# EAGLE design main (EAGLE 5.11)

## Sheet 1 of 2
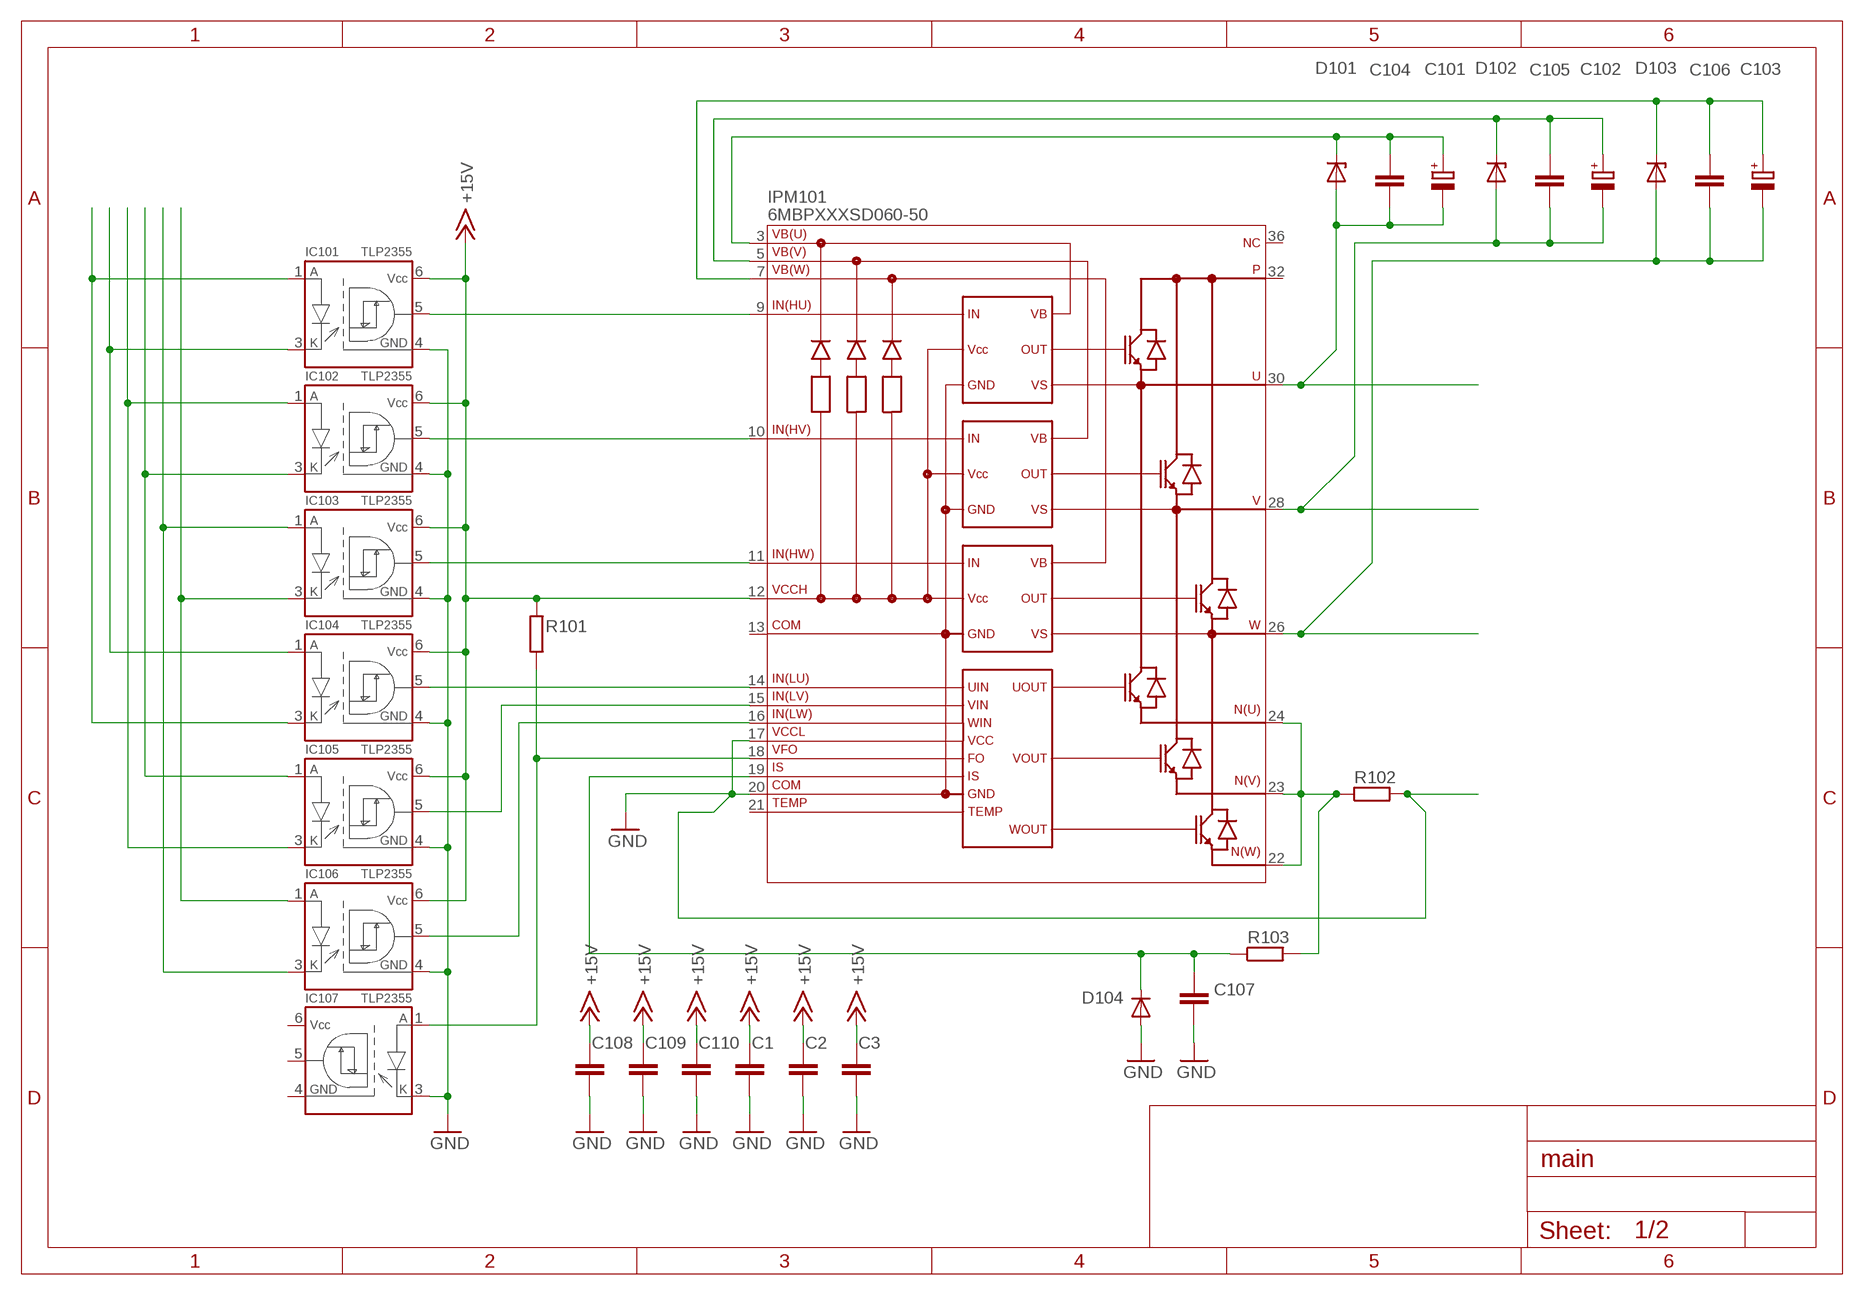
[diagram p0: schematic, sheet 1]

### Parts
C1  C-EUC0805  [C0805]
C2  C-EUC0805  [C0805]
C3  C-EUC0805  [C0805]
C101  CPOL-EU153CLV-0405  [153CLV-0405]
C102  CPOL-EU153CLV-0405  [153CLV-0405]
C103  CPOL-EU153CLV-0405  [153CLV-0405]
C104  C-EUC0805  [C0805]
C105  C-EUC0805  [C0805]
C106  C-EUC0805  [C0805]
C107  C-EUC0805  [C0805]
C108  C-EUC0805  [C0805]
C109  C-EUC0805  [C0805]
C110  C-EUC0805  [C0805]
D101  ZENER-DIODESOD80C  [SOD80C]
D102  ZENER-DIODESOD80C  [SOD80C]
D103  ZENER-DIODESOD80C  [SOD80C]
D104  DIODE-SOD123  [SOD123]
IC101  TLP2355  [11-4L1S]
IC102  TLP2355  [11-4L1S]
IC103  TLP2355  [11-4L1S]
IC104  TLP2355  [11-4L1S]
IC105  TLP2355  [11-4L1S]
IC106  TLP2355  [11-4L1S]
IC107  TLP2355  [11-4L1S]
IPM101  6MBPXXXSD060-50  6MBP  [6MBPXXXSD060-50]
R101  R-EU_R0805  [R0805]
R102  R-EU_R6332W  [R6332W]
R103  R-EU_R0805  [R0805]

### Nets
+15V: C1.1 C2.1 C3.1 C108.1 C109.1 C110.1 IC101.6(VCC) IC102.6(VCC) IC103.6(VCC) IC104.6(VCC) IC105.6(VCC) IC106.6(VCC) IPM101.12 R101.2
GND: C1.2 C2.2 C3.2 C107.2 C108.2 C109.2 C110.2 D104.A IC101.4(GND) IC102.4(GND) IC103.4(GND) IC104.4(GND) IC105.4(GND) IC106.4(GND) IC107.3(K) IPM101.17 IPM101.20 R102.2
N$1: IC107.1(A) IPM101.18 R101.1
N$2: C103.+ C106.2 D103.C IPM101.7
N$3: C102.+ C105.2 D102.C IPM101.5
N$4: C101.+ C104.2 D101.C IPM101.3
N$5: C103.- C106.1 D103.A IPM101.26
N$6: C102.- C105.1 D102.A IPM101.28
N$7: C101.- C104.1 D101.A IPM101.30
N$8: C107.1 D104.C IPM101.19 R103.1
N$9: IPM101.22 IPM101.23 IPM101.24 R102.1 R103.2
N$11: IC101.3(K) IC104.1(A)
N$12: IC101.1(A) IC104.3(K)
N$13: IC101.5(OUT) IPM101.9
N$14: IC102.5(OUT) IPM101.10
N$15: IC103.5(OUT) IPM101.11
N$16: IC104.5(OUT) IPM101.14
N$17: IC105.5(OUT) IPM101.15
N$18: IC106.5(OUT) IPM101.16
N$19: IC102.1(A) IC105.3(K)
N$20: IC102.3(K) IC105.1(A)
N$21: IC103.1(A) IC106.3(K)
N$22: IC103.3(K) IC106.1(A)
Unconnected: IC107.4(GND) IC107.5(OUT) IC107.6(VCC) IPM101.21 IPM101.36

## Sheet 2 of 2
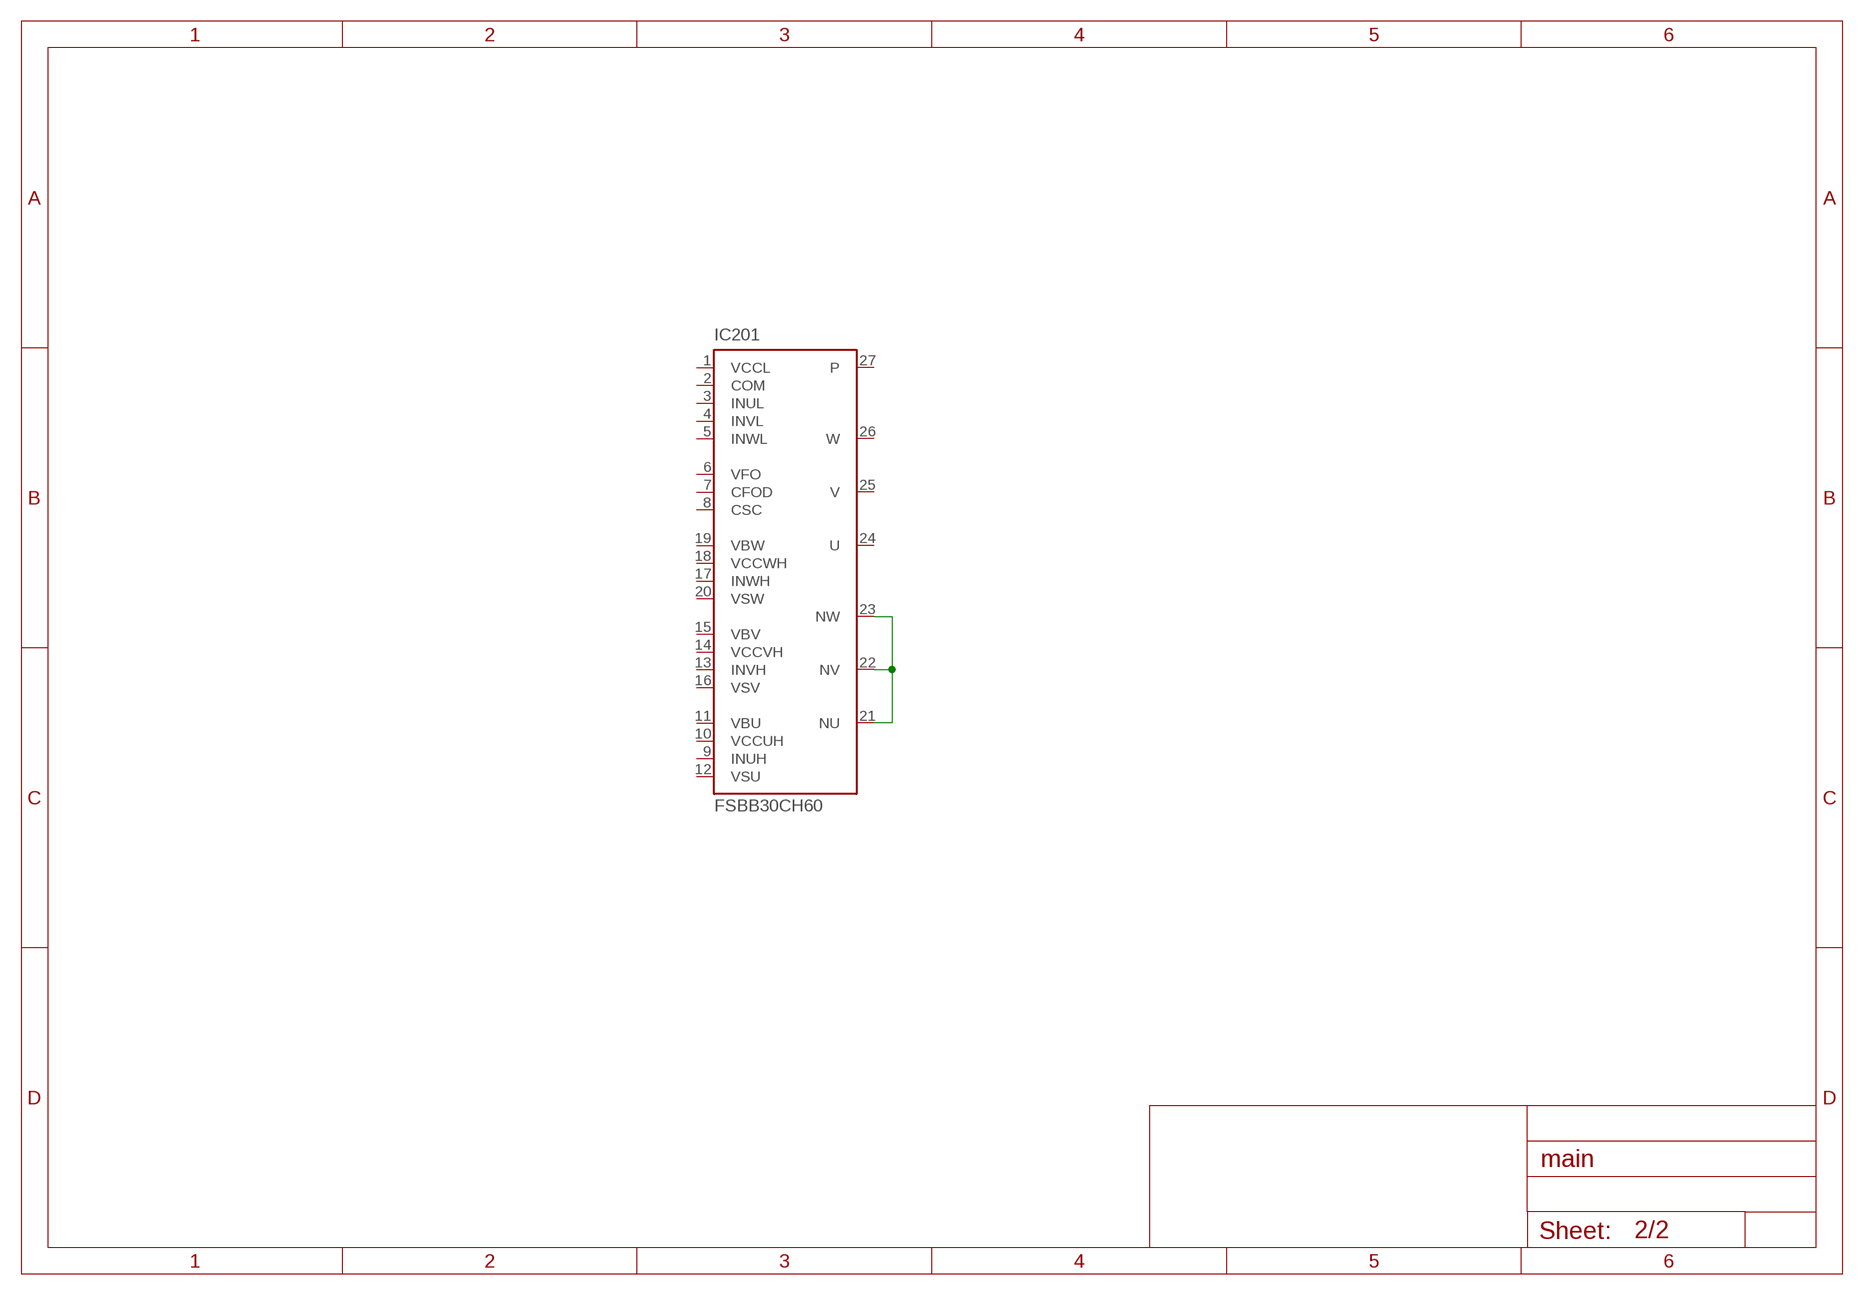
[diagram p1: schematic, sheet 2]

### Parts
IC201  FSBB30CH60  [FSBB30CH60]

### Nets
N$10: IC201.21(NU) IC201.22(NV) IC201.23(NW)
Unconnected: IC201.3(INUL) IC201.4(INVL) IC201.5(INWL) IC201.6(VFO) IC201.7(CFOD) IC201.8(CSC) IC201.9(INUH) IC201.10(VCCUH) IC201.11(VBU) IC201.12(VSU) IC201.13(INVH) IC201.14(VCCVH) IC201.15(VBV) IC201.16(VSV) IC201.17(INWH) IC201.18(VCCWH) IC201.19(VBW) IC201.20(VSW) IC201.24(U) IC201.25(V) IC201.26(W) IC201.27(P)

## Power pins joined to a net without a drawn wire
13: IPM101.13
32: IPM101.32
COM: IC201.2(COM)
VCCL: IC201.1(VCCL)

## Library data of the parts
C1-C3 C104-C110 = rcl:C-EU: CAPACITOR, European symbol
C101-C103 = rcl:CPOL-EU: POLARIZED CAPACITOR, European symbol
D101-D103 = diode:ZENER-DIODE: Z-Diode
D104 = diode:DIODE-: DIODE
IC101-IC107 = myToshiba:TLP2355
IC201 = fairchild-semic:FSBB30CH60: Smart Power Module 600V-30A IGBT inverter for three-phase DC/AC power conversion Source: http://www.fairchildsemi.com/ds/FS/FSBB30CH60.pdf; MPN: FSBB30CH60B; OC_FARNELL: 1783234; OC_NEWARK: 78M1076
IPM101 = myFujiElectric:6MBP*; X30SD060-50: X30SD060-50
R101-R103 = rcl:R-EU_: RESISTOR, European symbol

## Board
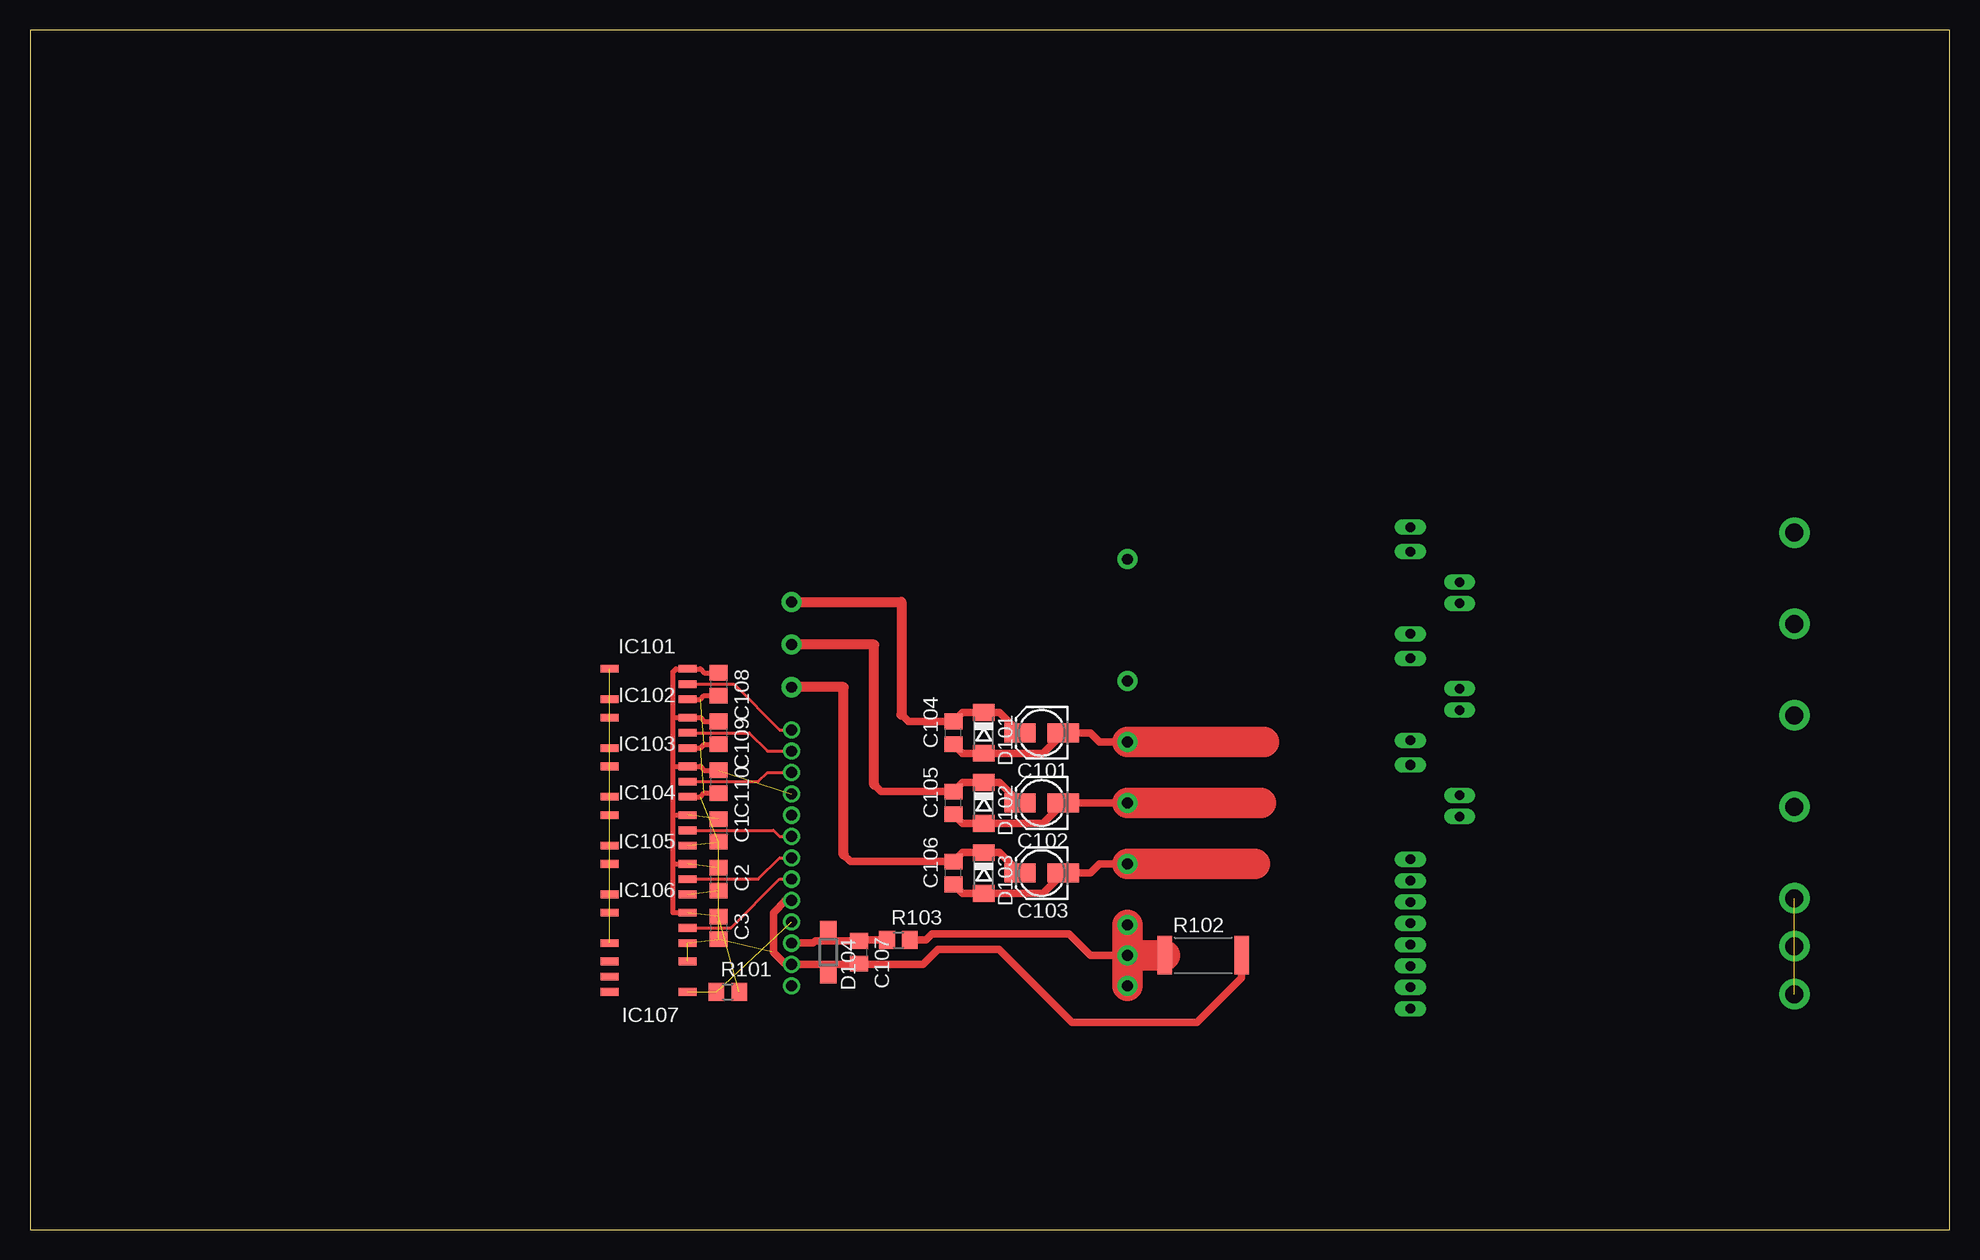
[diagram p2: board, top side]
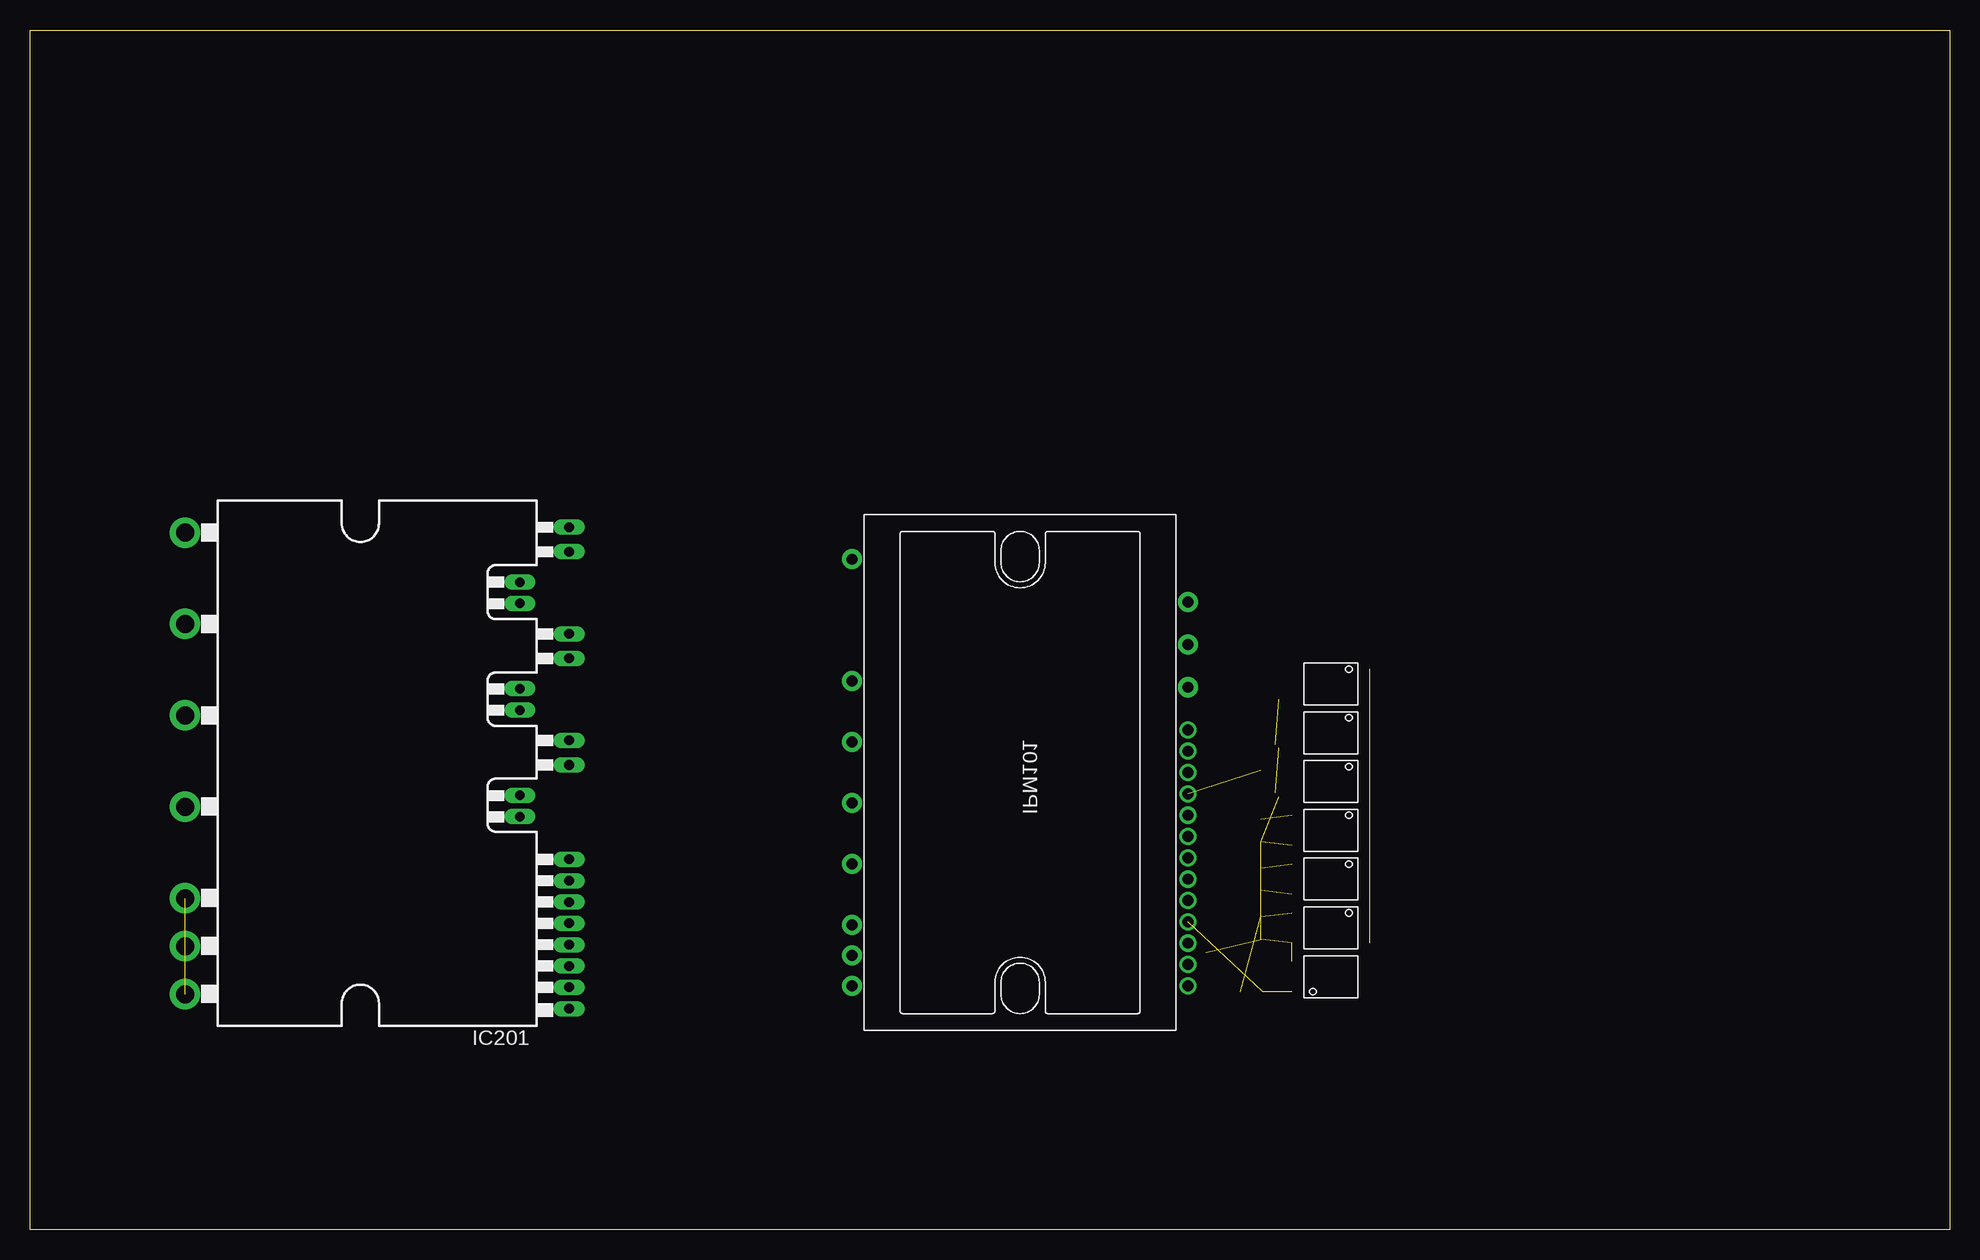
[diagram p3: board, bottom side, seen from below]

Size 160 x 100 mm. Coordinates in mm from the lower left corner, seen from the top.
Outline: 0,0 160,0 160,100 0,100 0,0
Copper layers (1*16): Top 0.035mm / dielectric 1.5mm / Bottom 0.035mm
Design rules "default": minimum track width 10mil, minimum drill 24mil, track to track 8mil, track to pad 8mil, pad to pad 8mil, via to via 8mil, smd to smd 8mil, copper to edge 40mil, drill to drill 8mil, minimum pad ring 10mil, minimum via ring 8mil, stop-mask expansion 4mil, vias tented up to drill 0mil, thermal gap 10mil

### Footprints (pad centres in the part's own frame; a part is rotated, then mirrored left to right if it is on the bottom)
C0805 = smd 1.3 x 1.5: 1 -0.95,0; 2 0.95,0
153CLV-0405 = smd 2.6 x 1.6: + 1.8,0; - -1.8,0
SOD80C = smd 1.4 x 1.8: A 1.7,0; C -1.7,0
SOD123 = smd 1.4 x 1.4: A 1.9,0; C -1.9,0
11-4L1S = smd 0.635 x 1.5: 1 -1.27,-3.25; 3 1.27,-3.25; 4 1.27,3.25; 5 0,3.25; 6 -1.27,3.25
FSBB30CH60 = drill 0.8 pad 1.27 long: 1 -20.447,-16; 2 -18.669,-16; 3 -16.891,-16; 4 -15.113,-16; 5 -13.335,-16; 6 -11.557,-16; 7 -9.779,-16; 8 -8.001,-16; 9 -4.445,-11.9; 10 -2.667,-11.9; 11 -0.136,-16; 12 1.914,-16; 13 4.445,-11.9; 14 6.223,-11.9; 15 8.754,-16; 16 10.804,-16; 17 13.335,-11.9; 18 15.113,-11.9; 19 17.644,-16; 20 19.694,-16 | drill 1.5 pad 2.54 round: 21 -19.24,16; 22 -15.24,16; 23 -11.24,16; 24 -3.62,16; 25 4,16; 26 11.62,16; 27 19.24,16
6MBPXXXSD060-50 = drill 0.9 pad 1.676 round: 3 14.224,14; 5 10.668,14; 7 7.112,14; 22 -17.78,-14; 23 -15.24,-14; 24 -12.7,-14; 26 -7.62,-14; 28 -2.54,-14; 30 2.54,-14; 32 7.62,-14; 36 17.78,-14 | drill 0.9 pad 1.422 round: 9 3.556,14; 10 1.778,14; 11 0,14; 12 -1.778,14; 13 -3.556,14; 14 -5.334,14; 15 -7.112,14; 16 -8.89,14; 17 -10.668,14; 18 -12.446,14; 19 -14.224,14; 20 -16.002,14; 21 -17.78,14
R0805 = smd 1.3 x 1.5: 1 -0.95,0; 2 0.95,0
R6332W = smd 1.2 x 3.2: 1 -3.196,0; 2 3.196,0

### Placement (x,y rotation side)
C1  57.4,33.27 270 top
C2  57.4,29.21 270 top
C3  57.4,25.15 270 top
C101  84.33,41.4 180 top
C102  84.33,35.56 180 top
C103  84.33,29.72 180 top
C104  76.96,41.4 90 top
C105  76.96,35.56 90 top
C106  76.96,29.72 90 top
C107  69.09,23.11 270 top
C108  57.4,45.47 270 top
C109  57.4,41.4 270 top
C110  57.4,37.34 270 top
D101  79.5,41.4 270 top
D102  79.5,35.56 270 top
D103  79.5,29.72 270 top
D104  66.55,23.11 270 top
IC101  51.56,45.47 270 top
IC102  51.56,41.4 270 top
IC103  51.56,37.34 270 top
IC104  51.56,33.27 270 top
IC105  51.56,29.21 270 top
IC106  51.56,25.15 270 top
IC107  51.56,21.08 90 top
IC201  131.06,38.86 90 bottom
IPM101  77.47,38.1 90 top
R101  58.17,19.81 0 top
R102  97.79,22.86 0 top
R103  72.39,24.13 0 top

### Tracks (layer width: path | path; a pad name or v marks a point on that pad's centre or on a via)
+15V  (5 unrouted)
  Top 0.406: 53.59,30.48 53.59,26.42 IC106.6 | 53.59,30.48 53.59,34.54 | 53.59,34.54 53.59,38.61 | 53.59,38.61 53.59,42.67 | 53.59,42.67 53.59,46.48 53.85,46.74 IC101.6 55.88,46.74 56.2,46.42 C108.1 | 53.59,42.67 IC102.6 55.88,42.67 56.2,42.35 C109.1 | 53.59,38.61 IC103.6 55.88,38.61 56.2,38.29 C110.1 | 53.59,34.54 IC104.6 | 53.59,30.48 IC105.6
GND  (10 unrouted)
  Top 0.406: 66.55,22.1 D104.A | C107.2 68.9,22.16 68.83,22.1 | IC101.4 55.88,44.2 56.2,44.52 C108.2 | IC103.4 55.88,36.07 56.2,36.39 C110.2 | IC102.4 55.88,40.13 56.2,40.45 C109.2
  Top 0.61: R102.2 100.99,20.98 97.28,17.27 86.87,17.27 80.77,23.37 75.69,23.37 74.42,22.1 68.83,22.1 66.55,22.1 IPM101.20 62.99,22.1 61.98,23.11 61.98,26.42 62.99,27.43 IPM101.17
N$1  (2 unrouted)
N$2
  Top 0.61: 67.82,31.24 68.39,30.67 C106.2 77.71,31.42 D103.C 80.83,31.42 C103.+
  Top 0.813: IPM101.7 67.82,45.21 67.82,31.24
N$3
  Top 0.61: 70.36,37.08 70.93,36.51 C105.2 77.71,37.26 D102.C 80.83,37.26 C102.+
  Top 0.813: IPM101.5 70.36,48.77 70.36,37.08
N$4
  Top 0.61: 72.64,42.93 73.22,42.35 C104.2 77.71,43.1 D101.C 80.83,43.1 C101.+
  Top 0.813: IPM101.3 72.64,52.32 72.64,42.93
N$5
  Top 0.61: C106.1 77.71,28.02 D103.A 84.43,28.02 C103.- 88.39,29.72 89.15,30.48 IPM101.26
  Top 2.54: IPM101.26 102.11,30.48
N$6
  Top 0.61: C105.1 77.71,33.86 D102.A 84.43,33.86 C102.- IPM101.28
  Top 2.54: IPM101.28 102.62,35.56
N$7
  Top 0.61: C104.1 77.71,39.7 D101.A 84.43,39.7 C101.- 88.39,41.4 89.15,40.64 IPM101.30
  Top 2.54: IPM101.30 102.87,40.64
N$8
  Top 0.406: 66.55,24.06 D104.C
  Top 0.61: IPM101.19 65.28,23.88 65.47,24.06 66.55,24.06 C107.1 69.15,24.13 R103.1
N$9
  Top 0.61: R103.2 74.68,24.13 75.18,24.64 86.61,24.64 88.39,22.86 IPM101.23
  Top 2.54: IPM101.23 IPM101.24 | IPM101.23 IPM101.22 | IPM101.23 R102.1
N$10  (2 unrouted)
N$11  (1 unrouted)
N$12  (1 unrouted)
N$13
  Top 0.254: IC101.5 58.67,45.47 62.48,41.66 IPM101.9
N$14
  Top 0.254: IC102.5 59.94,41.4 61.47,39.88 IPM101.10
N$15
  Top 0.254: IPM101.11 61.47,38.1 60.71,37.34 IC103.5
N$16
  Top 0.254: IPM101.14 62.48,32.77 61.98,33.27 IC104.5
N$17
  Top 0.254: IPM101.15 62.48,30.99 60.71,29.21 IC105.5
N$18
  Top 0.254: IPM101.16 62.48,29.21 58.42,25.15 IC106.5
N$19  (1 unrouted)
N$20  (1 unrouted)
N$21  (1 unrouted)
N$22  (1 unrouted)